# EAGLE schematic nxp_simplified (EAGLE 9.5.1)
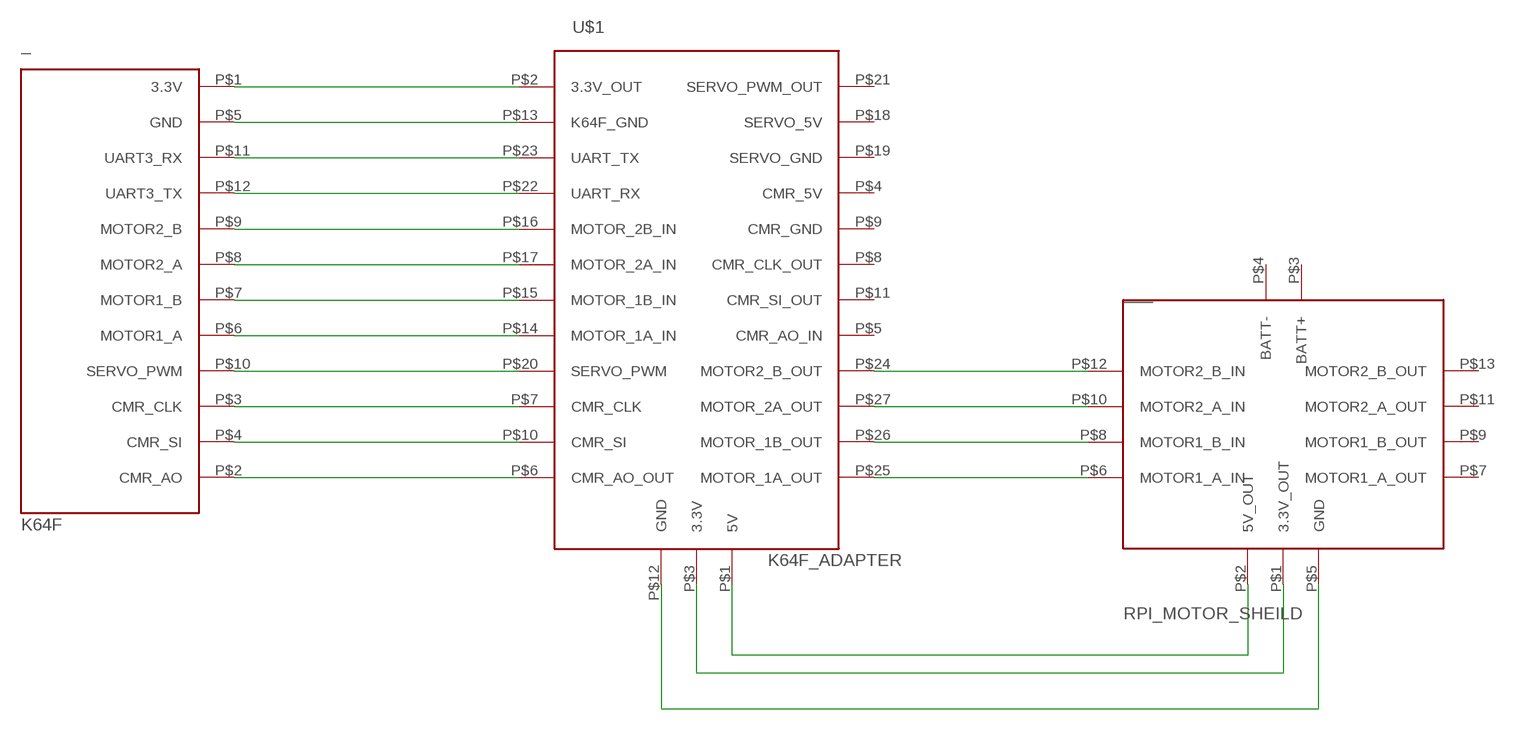
[diagram p0: schematic, sheet 1]

## Parts
_  K64F  [K64F]
___  RPI_MOTOR_SHEILD  [RPI_MOTOR_SHEILD]
U$1  K64F_ADAPTER  [K64F_ADAPTER]

## Nets
N$1: _.P$1(3.3V) U$1.P$2(3.3V_OUT)
N$2: _.P$5(GND) U$1.P$13(K64F_GND)
N$3: _.P$11(UART3_RX) U$1.P$23(UART_TX)
N$4: _.P$12(UART3_TX) U$1.P$22(UART_RX)
N$5: _.P$9(MOTOR2_B) U$1.P$16(MOTOR_2B_IN)
N$6: _.P$8(MOTOR2_A) U$1.P$17(MOTOR_2A_IN)
N$7: _.P$7(MOTOR1_B) U$1.P$15(MOTOR_1B_IN)
N$8: _.P$6(MOTOR1_A) U$1.P$14(MOTOR_1A_IN)
N$9: _.P$10(SERVO_PWM) U$1.P$20(SERVO_PWM)
N$10: _.P$3(CMR_CLK) U$1.P$7(CMR_CLK)
N$11: _.P$4(CMR_SI) U$1.P$10(CMR_SI)
N$12: _.P$2(CMR_AO) U$1.P$6(CMR_AO_OUT)
N$13: ___.P$5(GND) U$1.P$12(GND)
N$14: ___.P$1(3.3V_OUT) U$1.P$3(3.3V)
N$15: ___.P$2(5V_OUT) U$1.P$1(5V)
N$16: ___.P$6(MOTOR1_A_IN) U$1.P$25(MOTOR_1A_OUT)
N$17: ___.P$8(MOTOR1_B_IN) U$1.P$26(MOTOR_1B_OUT)
N$18: ___.P$10(MOTOR2_A_IN) U$1.P$27(MOTOR_2A_OUT)
N$19: ___.P$12(MOTOR2_B_IN) U$1.P$24(MOTOR2_B_OUT)
Unconnected: ___.P$3(BATT+) ___.P$4(BATT-) ___.P$7(MOTOR1_A_OUT) ___.P$9(MOTOR1_B_OUT) ___.P$11(MOTOR2_A_OUT) ___.P$13(MOTOR2_B_OUT) U$1.P$4(CMR_5V) U$1.P$5(CMR_AO_IN) U$1.P$8(CMR_CLK_OUT) U$1.P$9(CMR_GND) U$1.P$11(CMR_SI_OUT) U$1.P$18(SERVO_5V) U$1.P$19(SERVO_GND) U$1.P$21(SERVO_PWM_OUT)

## Library data of the parts
_ = CMPE-460-NXPCUP:K64F
___ = CMPE-460-NXPCUP:RPI_MOTOR_SHEILD
U$1 = CMPE-460-NXPCUP:K64F_ADAPTER